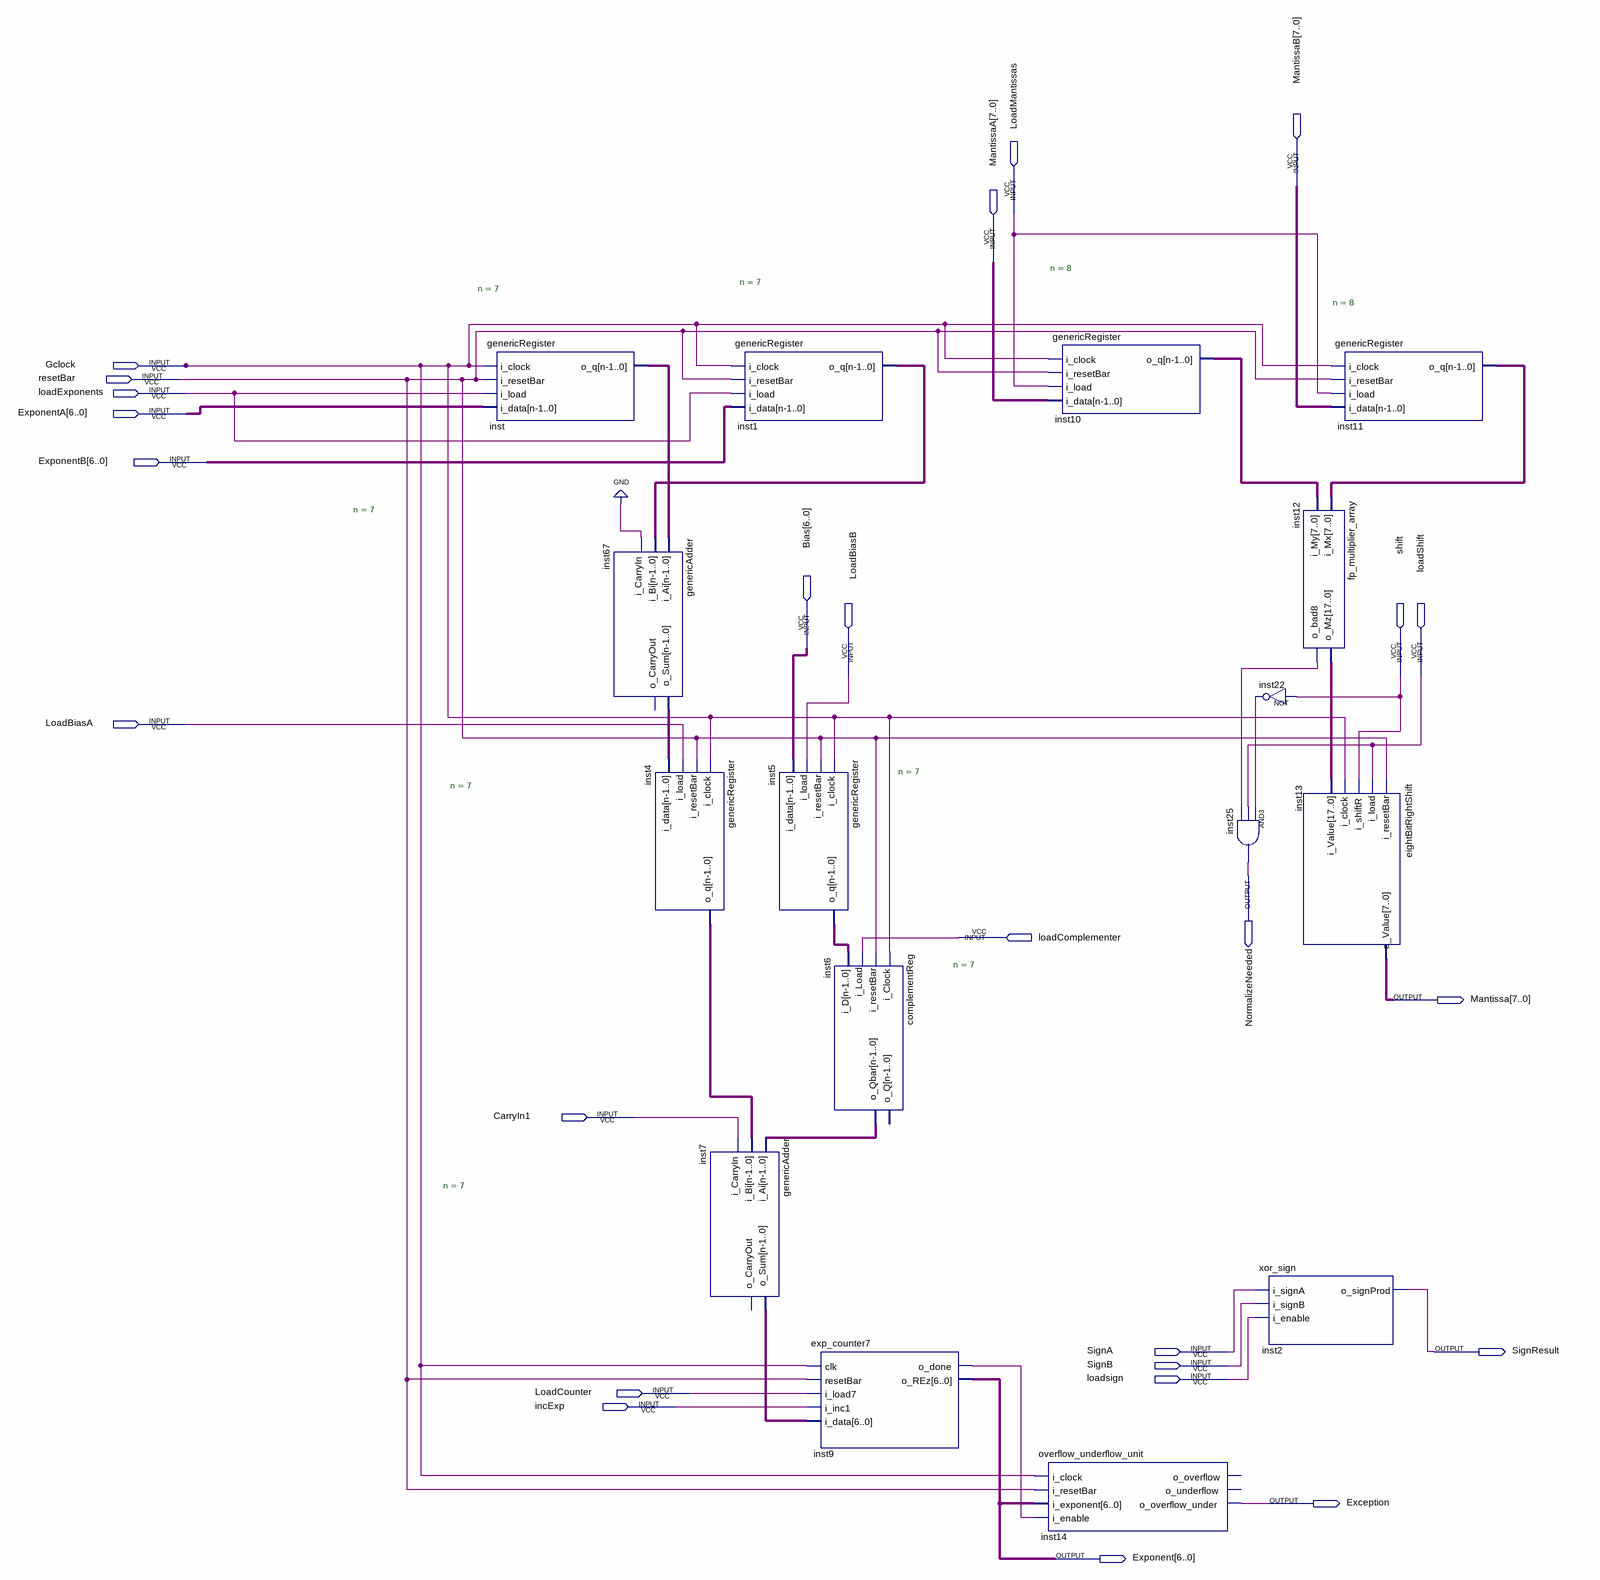
[diagram p0: schematic sheet]
// Quartus schematic fpMultiplier.bdf as structural Verilog: 16 symbols, 25 pins
module fpMultiplier (
  input  [7:0] MantissaB,
  input  LoadMantissas,
  input  [7:0] MantissaA,
  input  Gclock,
  input  resetBar,
  input  loadExponents,
  input  [6:0] ExponentA,
  input  [6:0] ExponentB,
  input  [6:0] Bias,
  input  LoadBiasB,
  input  shift,
  input  loadShift,
  input  LoadBiasA,
  input  loadComplementer,
  input  CarryIn1,
  input  SignA,
  input  SignB,
  input  loadsign,
  input  LoadCounter,
  input  incExp,
  output NormalizeNeeded,
  output [7:0] Mantissa,
  output SignResult,
  output Exception,
  output [6:0] Exponent
);

  wire inst9_o_done, inst12_o_bad8, inst22_out;
  wire [6:0] inst1_o_q, inst4_o_q, inst5_o_q, inst6_o_qbar, inst7_o_sum, inst67_o_sum, inst_o_q;
  wire [7:0] inst10_o_q, inst11_o_q;
  wire [17:0] inst12_o_mz;

  genericRegister #(.n(7)) inst (
    .i_clock(Gclock), .i_resetBar(resetBar), .i_load(loadExponents), .i_data(ExponentA), .o_q(inst_o_q));
  genericAdder #(.n(7)) inst67 (
    .i_Ai(inst_o_q), .i_Bi(inst1_o_q), .i_CarryIn(1'b0), .o_Sum(inst67_o_sum));  // open: o_CarryOut
  genericRegister #(.n(7)) inst4 (
    .i_clock(Gclock), .i_resetBar(resetBar), .i_load(LoadBiasA), .i_data(inst67_o_sum), .o_q(inst4_o_q));
  genericAdder #(.n(7)) inst7 (
    .i_Ai(inst6_o_qbar), .i_Bi(inst4_o_q), .i_CarryIn(CarryIn1), .o_Sum(inst7_o_sum));  // open: o_CarryOut
  genericRegister #(.n(7)) inst1 (
    .i_clock(Gclock), .i_resetBar(resetBar), .i_load(loadExponents), .i_data(ExponentB), .o_q(inst1_o_q));
  genericRegister #(.n(7)) inst5 (
    .i_clock(Gclock), .i_resetBar(resetBar), .i_load(LoadBiasB), .i_data(Bias), .o_q(inst5_o_q));
  complementReg #(.n(7)) inst6 (
    .i_Clock(Gclock), .i_resetBar(resetBar), .i_Load(loadComplementer), .i_D(inst5_o_q), .o_Qbar(inst6_o_qbar));  // open: o_Q
  exp_counter7 inst9 (
    .clk(Gclock), .resetBar(resetBar), .i_load7(LoadCounter), .i_inc1(incExp), .i_data(inst7_o_sum),
    .o_done(inst9_o_done), .o_REz(Exponent));
  genericRegister #(.n(8)) inst10 (
    .i_clock(Gclock), .i_resetBar(resetBar), .i_load(LoadMantissas), .i_data(MantissaA), .o_q(inst10_o_q));
  overflow_underflow_unit inst14 (
    .i_clock(Gclock), .i_resetBar(resetBar), .i_exponent(Exponent), .i_enable(inst9_o_done),
    .o_overflow_under(Exception));  // open: o_overflow, o_underflow
  not inst22 (inst22_out, shift);
  and inst25 (NormalizeNeeded, inst22_out, loadShift, inst12_o_bad8);
  xor_sign inst2 (.i_signA(SignA), .i_signB(SignB), .i_enable(loadsign), .o_signProd(SignResult));
  fp_multiplier_array inst12 (.i_Mx(inst11_o_q), .i_My(inst10_o_q), .o_Mz(inst12_o_mz), .o_bad8(inst12_o_bad8));
  eightBitRightShift inst13 (
    .i_resetBar(resetBar), .i_load(loadShift), .i_shiftR(shift), .i_clock(Gclock), .i_Value(inst12_o_mz),
    .o_Value(Mantissa));
  genericRegister #(.n(8)) inst11 (
    .i_clock(Gclock), .i_resetBar(resetBar), .i_load(LoadMantissas), .i_data(MantissaB), .o_q(inst11_o_q));
endmodule
